# EAGLE design untitled (EAGLE 8.3.1)
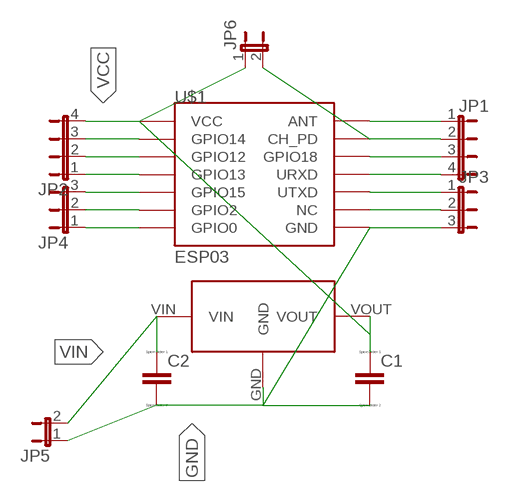
[diagram p0: schematic, sheet 1]

## Parts
C1  CC0603  [C0603]
C2  CC0603  [C0603]
JP1  JP4E  [JP4]
JP2  JP4E  [JP4]
JP3  JP2E  [JP2]
JP4  JP2E  [JP2]
JP5  JP1E  [JP1]
JP6  JP1E  [JP1]
U$1  ESP03  [ESP03]
U$3  HT7333  [SOT89]

## Nets
GND: C1.2 C2.2 JP3.3 JP5.1 U$1.GND U$3.GND
N$4: JP1.1 U$1.ANT
N$5: JP1.2 JP6.2 U$1.CH_PD
N$6: JP1.3 U$1.GPIO18
N$7: JP1.4 U$1.URXD
N$8: JP3.1 U$1.UTXD
N$9: JP3.2 U$1.NC
N$10: JP2.3 U$1.GPIO14
N$11: JP2.2 U$1.GPIO12
N$12: JP2.1 U$1.GPIO13
N$13: JP4.3 U$1.GPIO15
N$14: JP4.2 U$1.GPIO2
N$15: JP4.1 U$1.GPIO0
VCC: C1.1 JP2.4 JP6.1 U$1.VCC U$3.VOUT
VIN: C2.1 JP5.2 U$3.VIN

## Library data of the parts
C1 C2 = eagle-ltspice:C: CAPACITOR, European symbol; SPICEMODEL: NONE; SPICEPREFIX: C
JP1 JP2 = jumper:JP4E: JUMPER
JP3 JP4 = jumper:JP2E: JUMPER
JP5 JP6 = jumper:JP1E: JUMPER
U$1 = esp8266modules:ESP03: ESP8266 Wifi module 03; DIMENSIONS: 17.3 x 12.1 mm; PINS: 14; PITCH: 0.078" / 2 mm
U$3 = HT7333_SOT89:HT7333

## Board
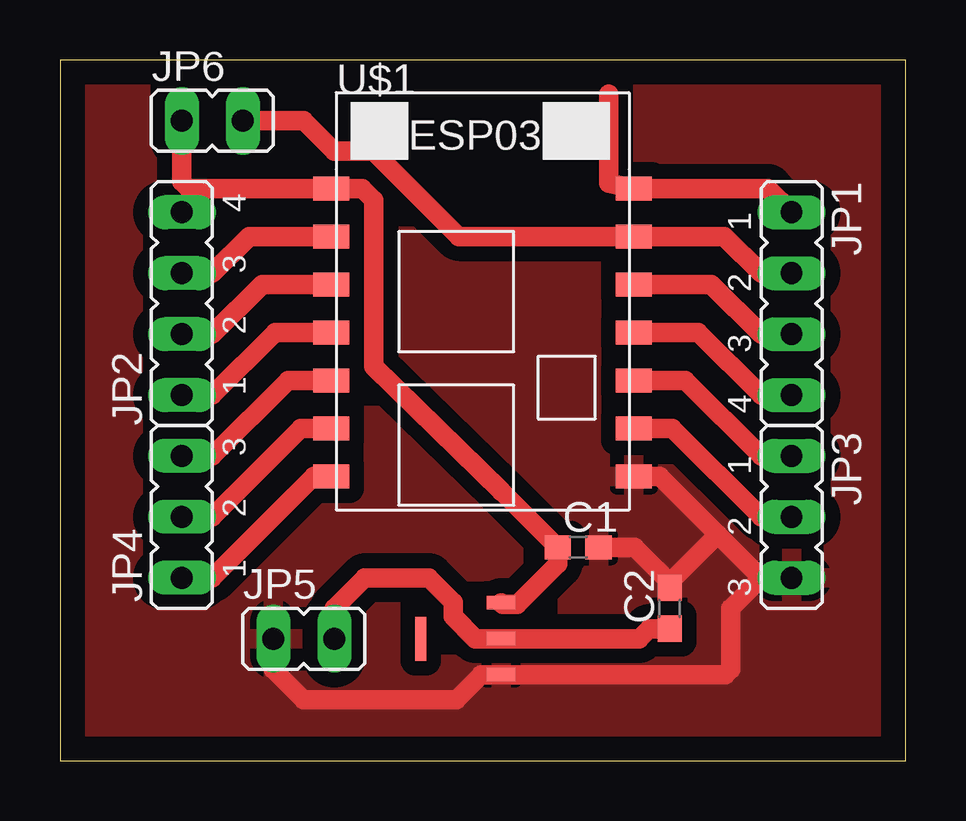
[diagram p1: board, top side]

Size 35.23 x 29.21 mm. Coordinates in mm from the lower left corner, seen from the top.
Outline: 0,0 35.23,0 35.23,29.2 2.54,29.21 0,29.2 0,0
Copper layers (1*16): Top 0.035mm / dielectric 1.5mm / Bottom 0.035mm
Design rules "default *": minimum track width 6mil, minimum drill 0.35mm, track to track 24mil, track to pad 24mil, pad to pad 24mil, via to via 24mil, smd to smd 24mil, copper to edge 40mil, drill to drill 6mil, minimum pad ring 10mil, minimum via ring 8mil, stop-mask expansion 4mil, vias tented up to drill 0mil, thermal gap 10mil

### Footprints (pad centres in the part's own frame; a part is rotated, then mirrored left to right if it is on the bottom)
C0603 = smd 1.1 x 1: 1 -0.85,0; 2 0.85,0
JP4 = drill 0.914 long: 1 -3.81,0; 2 -1.27,0; 3 1.27,0; 4 3.81,0
JP2 = drill 0.914 long: 1 -2.54,0; 2 0,0; 3 2.54,0
JP1 = drill 0.914 long: 1 0,-1.27; 2 0,1.27
ESP03 = smd 1.5 x 1: ANT 7.4,4.8; CH_PD 7.4,2.8; GND 7.4,-7.2; GPIO0 -5.2,-7.2; GPIO2 -5.2,-5.2; GPIO12 -5.2,0.8; GPIO13 -5.2,-1.2; GPIO14 -5.2,2.8; GPIO15 -5.2,-3.2; GPIO18 7.4,0.8; NC 7.4,-5.2; URXD 7.4,-1.2; UTXD 7.4,-3.2; VCC -5.2,4.8
SOT89 = smd 0.559 x 1.194: GND -1.499,-0.597; VIN 0,-0.597; VOUT 1.499,-0.597 | smd 1.829 x 0.457: P$4 0,2.743

### Placement (x,y rotation side)
C1  21.59,8.89 0 top
C2  25.4,6.35 90 top
JP1  30.48,19.05 270 top
JP2  5.08,19.05 90 top
JP3  30.48,10.16 270 top
JP4  5.08,10.16 90 top
JP5  10.16,5.08 270 top
JP6  6.35,26.67 270 top
U$1  16.51,19.05 0 top
U$3  17.78,5.08 90 top

### Tracks (layer width: path | path; a pad name or v marks a point on that pad's centre or on a via)
GND
  Top 0.813: U$1.GND 24.98,11.85 27.4,9.43 | 29.21,7.62 27.4,9.43 | 29.21,7.62 JP3.3 | 25.4,7.44 C2.2 | 25.4,7.44 27.4,9.43 | 29.21,7.62 27.94,6.35 27.94,3.81 27.71,3.58 U$3.GND 17.55,3.58 16.51,2.54 10.16,2.54 8.89,3.81 JP5.1 | C1.2 23.95,8.89 25.4,7.44
  pour Top: 0,29.21 0,0 35.56,0 35.56,29.21
N$4
  Top 0.813: JP1.1 29.49,23.85 U$1.ANT 22.86,24.07 22.86,27.78
N$5
  Top 0.813: JP1.2 29.21,20.32 27.68,21.85 U$1.CH_PD 16.61,21.85 13.06,25.4 11.43,25.4 10.16,26.67 JP6.2
N$6
  Top 0.813: U$1.GPIO18 27.14,19.85 29.21,17.78 JP1.3
N$7
  Top 0.813: U$1.URXD 26.6,17.85 29.21,15.24 JP1.4
N$8
  Top 0.813: U$1.UTXD 26.06,15.85 29.21,12.7 JP3.1
N$9
  Top 0.813: U$1.NC 25.52,13.85 29.21,10.16 JP3.2
N$10
  Top 0.813: U$1.GPIO14 7.88,21.85 6.35,20.32 JP2.3
N$11
  Top 0.813: U$1.GPIO12 8.42,19.85 6.35,17.78 JP2.2
N$12
  Top 0.813: JP2.1 6.35,15.24 8.96,17.85 U$1.GPIO13
N$13
  Top 0.813: U$1.GPIO15 9.5,15.85 6.35,12.7 JP4.3
N$14
  Top 0.813: U$1.GPIO2 10.04,13.85 6.35,10.16 JP4.2
N$15
  Top 0.813: U$1.GPIO0 10.58,11.85 6.35,7.62 JP4.1
VCC
  Top 0.813: 6.07,23.85 U$1.VCC 12.6,23.85 13.08,23.37 13.08,16.42 18.39,11.24 | 6.07,23.85 JP2.4 | C1.1 20.69,8.89 | 18.39,11.24 C1.1 | 18.38,11.22 18.39,11.24 | 6.07,23.85 5.36,23.85 5.08,24.13 JP6.1 | U$3.VOUT 18.45,6.5 19.05,6.5 20.74,8.19 C1.1
VIN
  Top 0.813: C2.1 24.55,5.5 24.13,5.08 U$3.VIN 17.31,5.08 16.38,6 16.38,6.6 15.37,7.62 12.7,7.62 11.43,6.35 JP5.2